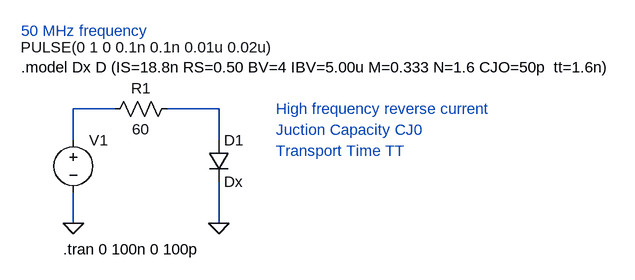
[diagram p0: schematic pulse.asc]
pulse.asc, the LTspice schematic file:
Version 4
SHEET 1 880 680
WIRE -352 240 -416 240
WIRE -192 240 -272 240
WIRE -416 288 -416 240
WIRE -192 288 -192 240
WIRE -416 416 -416 368
WIRE -192 416 -192 352
FLAG -416 416 0
FLAG -192 416 0
SYMBOL voltage -416 272 R0
WINDOW 123 0 0 Left 2
WINDOW 39 0 0 Left 2
WINDOW 3 -81 -127 Left 2
SYMATTR Value PULSE(0 1 0 0.1n 0.1n 0.01u 0.02u)
SYMATTR InstName V1
SYMBOL diode -208 288 R0
SYMATTR InstName D1
SYMATTR Value Dx
SYMBOL res -256 224 R90
WINDOW 0 0 56 VBottom 2
WINDOW 3 32 56 VTop 2
SYMATTR InstName R1
SYMATTR Value 60
TEXT -432 456 Left 2 !.tran 0 100n 0 100p
TEXT -496 176 Left 2 !.model Dx D (IS=18.8n RS=0.50 BV=4 IBV=5.00u M=0.333 N=1.6 CJO=50p  tt=1.6n)
TEXT -104 240 Left 2 ;High frequency reverse current
TEXT -104 272 Left 2 ;Juction Capacity CJ0
TEXT -104 304 Left 2 ;Transport Time TT
TEXT -496 120 Left 2 ;50 MHz frequency

The netlist it stands for:
* pulse.asc
V1 N001 0 PULSE(0 1 0 0.1n 0.1n 0.01u 0.02u)
D1 N002 0 Dx
R1 N002 N001 60
.model D D
.lib standard.dio
.tran 0 100n 0 100p
.model Dx D (IS=18.8n RS=0.50 BV=4 IBV=5.00u M=0.333 N=1.6 CJO=50p  tt=1.6n)
* High frequency reverse current
* Juction Capacity CJ0
* Transport Time TT
* 50 MHz frequency
.backanno
.end